# Altium schematic sheet Sheet1.SchDoc
size 381 x 177 mm; SheetNumber: 1; SheetTotal: 1
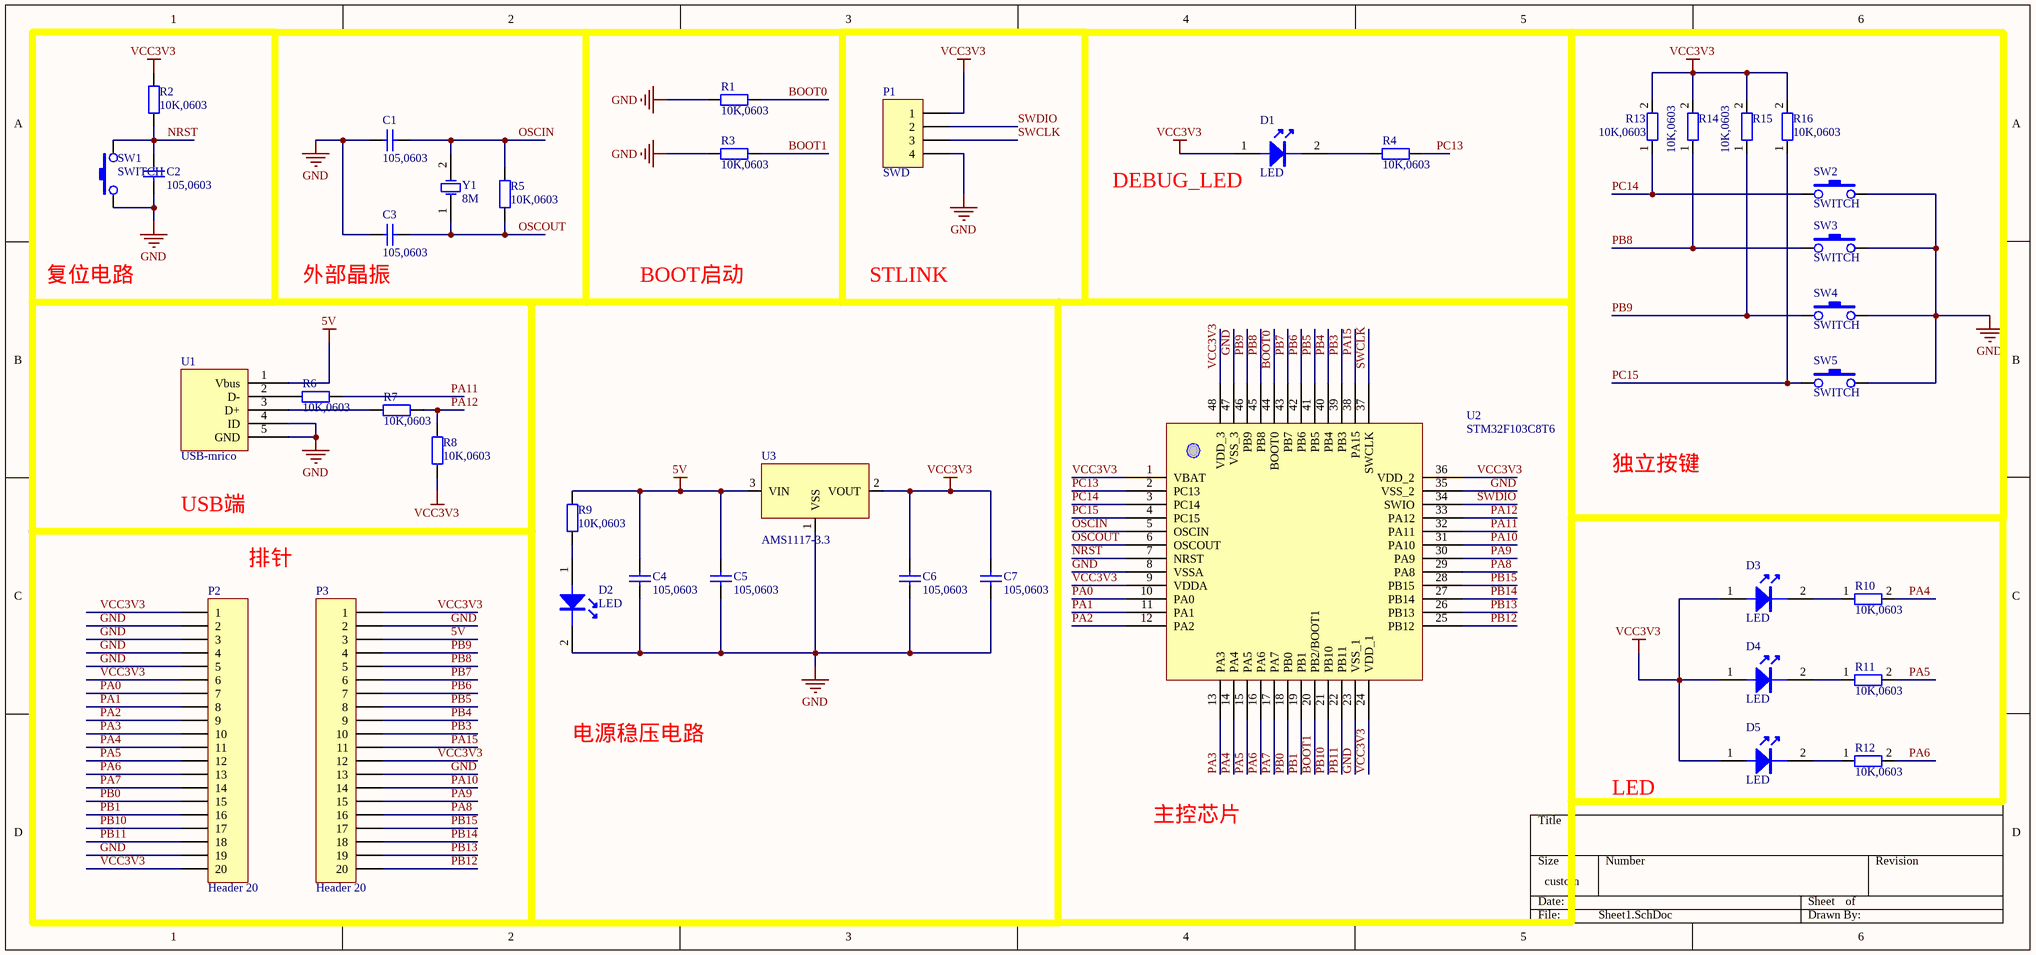
[diagram p0: Sheet1.SchDoc]

## Parts
C1  105,0603  [CAP 0603]
C2  105,0603  [CAP 0603]
C3  105,0603  [CAP 0603]
C4  105,0603  [CAP 0603]
C5  105,0603  [CAP 0603]
C6  105,0603  [CAP 0603]
C7  105,0603  [CAP 0603]
D1  LED  [LED 0603R]
D2  LED  [LED 0603R]
D3  LED  [LED 0603R]
D4  LED  [LED 0603R]
D5  LED  [LED 0603R]
P1  SWD  [HDR2.54-WI-4P]
P2  Header 20  [HDR2.54-LI-20P]
P3  Header 20  [HDR2.54-LI-20P]
R1  10K,0603  [RES 0603]
R2  10K,0603  [RES 0603]
R3  10K,0603  [RES 0603]
R4  10K,0603  [RES 0603]
R5  10K,0603  [RES 0603]
R6  10K,0603  [RES 0603]
R7  10K,0603  [RES 0603]
R8  10K,0603  [RES 0603]
R9  10K,0603  [RES 0603]
R10  10K,0603  [RES 0603]
R11  10K,0603  [RES 0603]
R12  10K,0603  [RES 0603]
R13  10K,0603  [RES 0603]
R14  10K,0603  [RES 0603]
R15  10K,0603  [RES 0603]
R16  10K,0603  [RES 0603]
SW1  SWITCH  [TSW SMD-6*6*5]
SW2  SWITCH  [TSW SMD-6*6*5]
SW3  SWITCH  [TSW SMD-6*6*5]
SW4  SWITCH  [TSW SMD-6*6*5]
SW5  SWITCH  [TSW SMD-6*6*5]
U1  USB-mrico  [USB-micro_A]
U2  STM32F103C8T6  [LQFP48 7X7_N]
U3  AMS1117-3.3  [SOT223]
Y1  8M  [OSC HC-49SMD]

## Blocks framed on the sheet
复位电路: C2 R2 SW1

## Nets
5V: C4.2 C5.2 P3.3 R9.2 U1.1(Vbus) U3.3(VIN)
GND: C1.1 C2.1 C3.1 C4.1 C5.1 C6.1 C7.1 D2.2 P1.4 P2.2 P2.3 P2.4 P2.5 P2.19 P3.2 P3.13 R1.1 R3.1 SW1.1 SW2.2 SW3.2 SW4.2 SW5.2 U1.4(ID) U1.5(GND) U2.8(VSSA) U2.23(VSS_1) U2.35(VSS_2) U2.47(VSS_3) U3.1(VSS)
VCC3V3: C6.2 C7.2 D1.1 D3.1 D4.1 D5.1 P1.1 P2.1 P2.6 P2.20 P3.1 P3.12 R2.2 R8.1 R13.2 R14.2 R15.2 R16.2 U2.1(VBAT) U2.9(VDDA) U2.24(VDD_1) U2.36(VDD_2) U2.48(VDD_3) U3.2(VOUT)
BOOT0: R1.2 U2.44(BOOT0)
BOOT1: R3.2 U2.20(PB2/BOOT1)
NRST: C2.2 R2.1 SW1.2 U2.7(NRST)
OSCIN: C1.2 R5.2 U2.5(OSCIN) Y1.2(OSC2)
OSCOUT: C3.2 R5.1 U2.6(OSCOUT) Y1.1(OSC1)
PA0: P2.7 U2.10(PA0)
PA1: P2.8 U2.11(PA1)
PA2: P2.9 U2.12(PA2)
PA3: P2.10 U2.13(PA3)
PA4: P2.11 R10.2 U2.14(PA4)
PA5: P2.12 R11.2 U2.15(PA5)
PA6: P2.13 R12.2 U2.16(PA6)
PA7: P2.14 U2.17(PA7)
PA8: P3.16 U2.29(PA8)
PA9: P3.15 U2.30(PA9)
PA10: P3.14 U2.31(PA10)
PA11: R6.2 U2.32(PA11)
PA12: R7.2 R8.2 U2.33(PA12)
PA15: P3.11 U2.38(PA15)
PB0: P2.15 U2.18(PB0)
PB1: P2.16 U2.19(PB1)
PB3: P3.10 U2.39(PB3)
PB4: P3.9 U2.40(PB4)
PB5: P3.8 U2.41(PB5)
PB6: P3.7 U2.42(PB6)
PB7: P3.6 U2.43(PB7)
PB8: P3.5 R14.1 SW3.1 U2.45(PB8)
PB9: P3.4 R15.1 SW4.1 U2.46(PB9)
PB10: P2.17 U2.21(PB10)
PB11: P2.18 U2.22(PB11)
PB12: P3.20 U2.25(PB12)
PB13: P3.19 U2.26(PB13)
PB14: P3.18 U2.27(PB14)
PB15: P3.17 U2.28(PB15)
PC13: R4.2 U2.2(PC13)
PC14: R13.1 SW2.1 U2.3(PC14)
PC15: R16.1 SW5.1 U2.4(PC15)
SWCLK: P1.3 U2.37(SWCLK)
SWDIO: P1.2 U2.34(SWIO)
NetD1_2: D1.2 R4.1
NetD2_1: D2.1 R9.1
NetD3_2: D3.2 R10.1
NetD4_2: D4.2 R11.1
NetD5_2: D5.2 R12.1
NetR6_1: R6.1 U1.2(D-)
NetR7_1: R7.1 U1.3(D+)

## Notes on the sheet
- (near D1) DEBUG_LED
- (near C3) 外部晶振
- BOOT启动
- STLINK
- 独立按键
- USB端
- 排针
- 电源稳压电路
- 主控芯片
- LED

## Library data of the parts
C1-C7 = Cap: Capacitor; Value: 104; Published: 8-Jun-2000; LatestRevisionDate: 17-Jul-2002; LatestRevisionNote: Re-released for DXP Platform.; Publisher: Altium Limited
P1 = Header 4: Header, 4-Pin; LatestRevisionDate: 17-Jul-2002; LatestRevisionNote: Re-released for DXP Platform.; Publisher: Altium Limited
P2 P3 = Header 20: Header, 20-Pin; LatestRevisionDate: 17-Jul-2002; LatestRevisionNote: Re-released for DXP Platform.; Publisher: Altium Limited
R1-R16 = Res: Resistor; Published: 8-Jun-2000; LatestRevisionDate: 17-Jul-2002; LatestRevisionNote: Re-released for DXP Platform.; Publisher: Altium Limited
U1 = USB-MICRO
U3 = AMS1117: 5V转3.3V
Y1 = XTAL: Crystal Oscillator; Published: 8-Jun-2000; LatestRevisionDate: 17-Jul-2002; LatestRevisionNote: Re-released for DXP Platform.; Publisher: Altium Limited